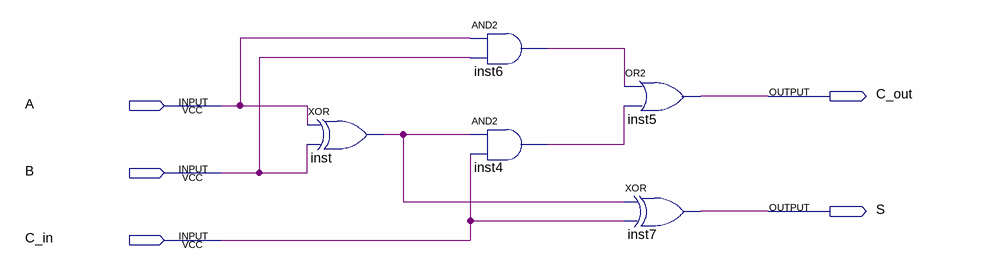
[diagram p0: schematic sheet]
// Quartus schematic FA.bdf as structural Verilog: 5 symbols, 5 pins
module FA (
  input  A,
  input  B,
  input  C_in,
  output C_out,
  output S
);

  wire inst4_out, inst6_out, inst_out;

  xor inst (inst_out, A, B);
  and inst6 (inst6_out, A, B);
  and inst4 (inst4_out, inst_out, C_in);
  or inst5 (C_out, inst6_out, inst4_out);
  xor inst7 (S, inst_out, C_in);
endmodule
